# Altium schematic sheet dv_mcu_mcu.SchDoc: =GlobalProjectName
size 410 x 297 mm; ApprovedBy: Утвердил; CheckedBy: Проверил; Author: Разработал; SheetNumber: 2; SheetTotal: 6; PageSetup: Record=PageOptions|CenterHorizontal=True|CenterVertical=True|PrintScale=1.00|XCorrection=1.00|YCorrection=1.00|PrintKind=1|BorderSize=5000000|LeftOffset=0|BottomOffset=0|Orientation=2|PaperLength=1000|PaperWidth=1000|Scale=100|PaperSource=15|PrintQuality=1200|MediaType=1|DitherType=10|PaperKind=A3|PrintScaleMode=1; Weight: -; ScaleFactor: -; NormInspection: Норм.Контр.; Time: Листов
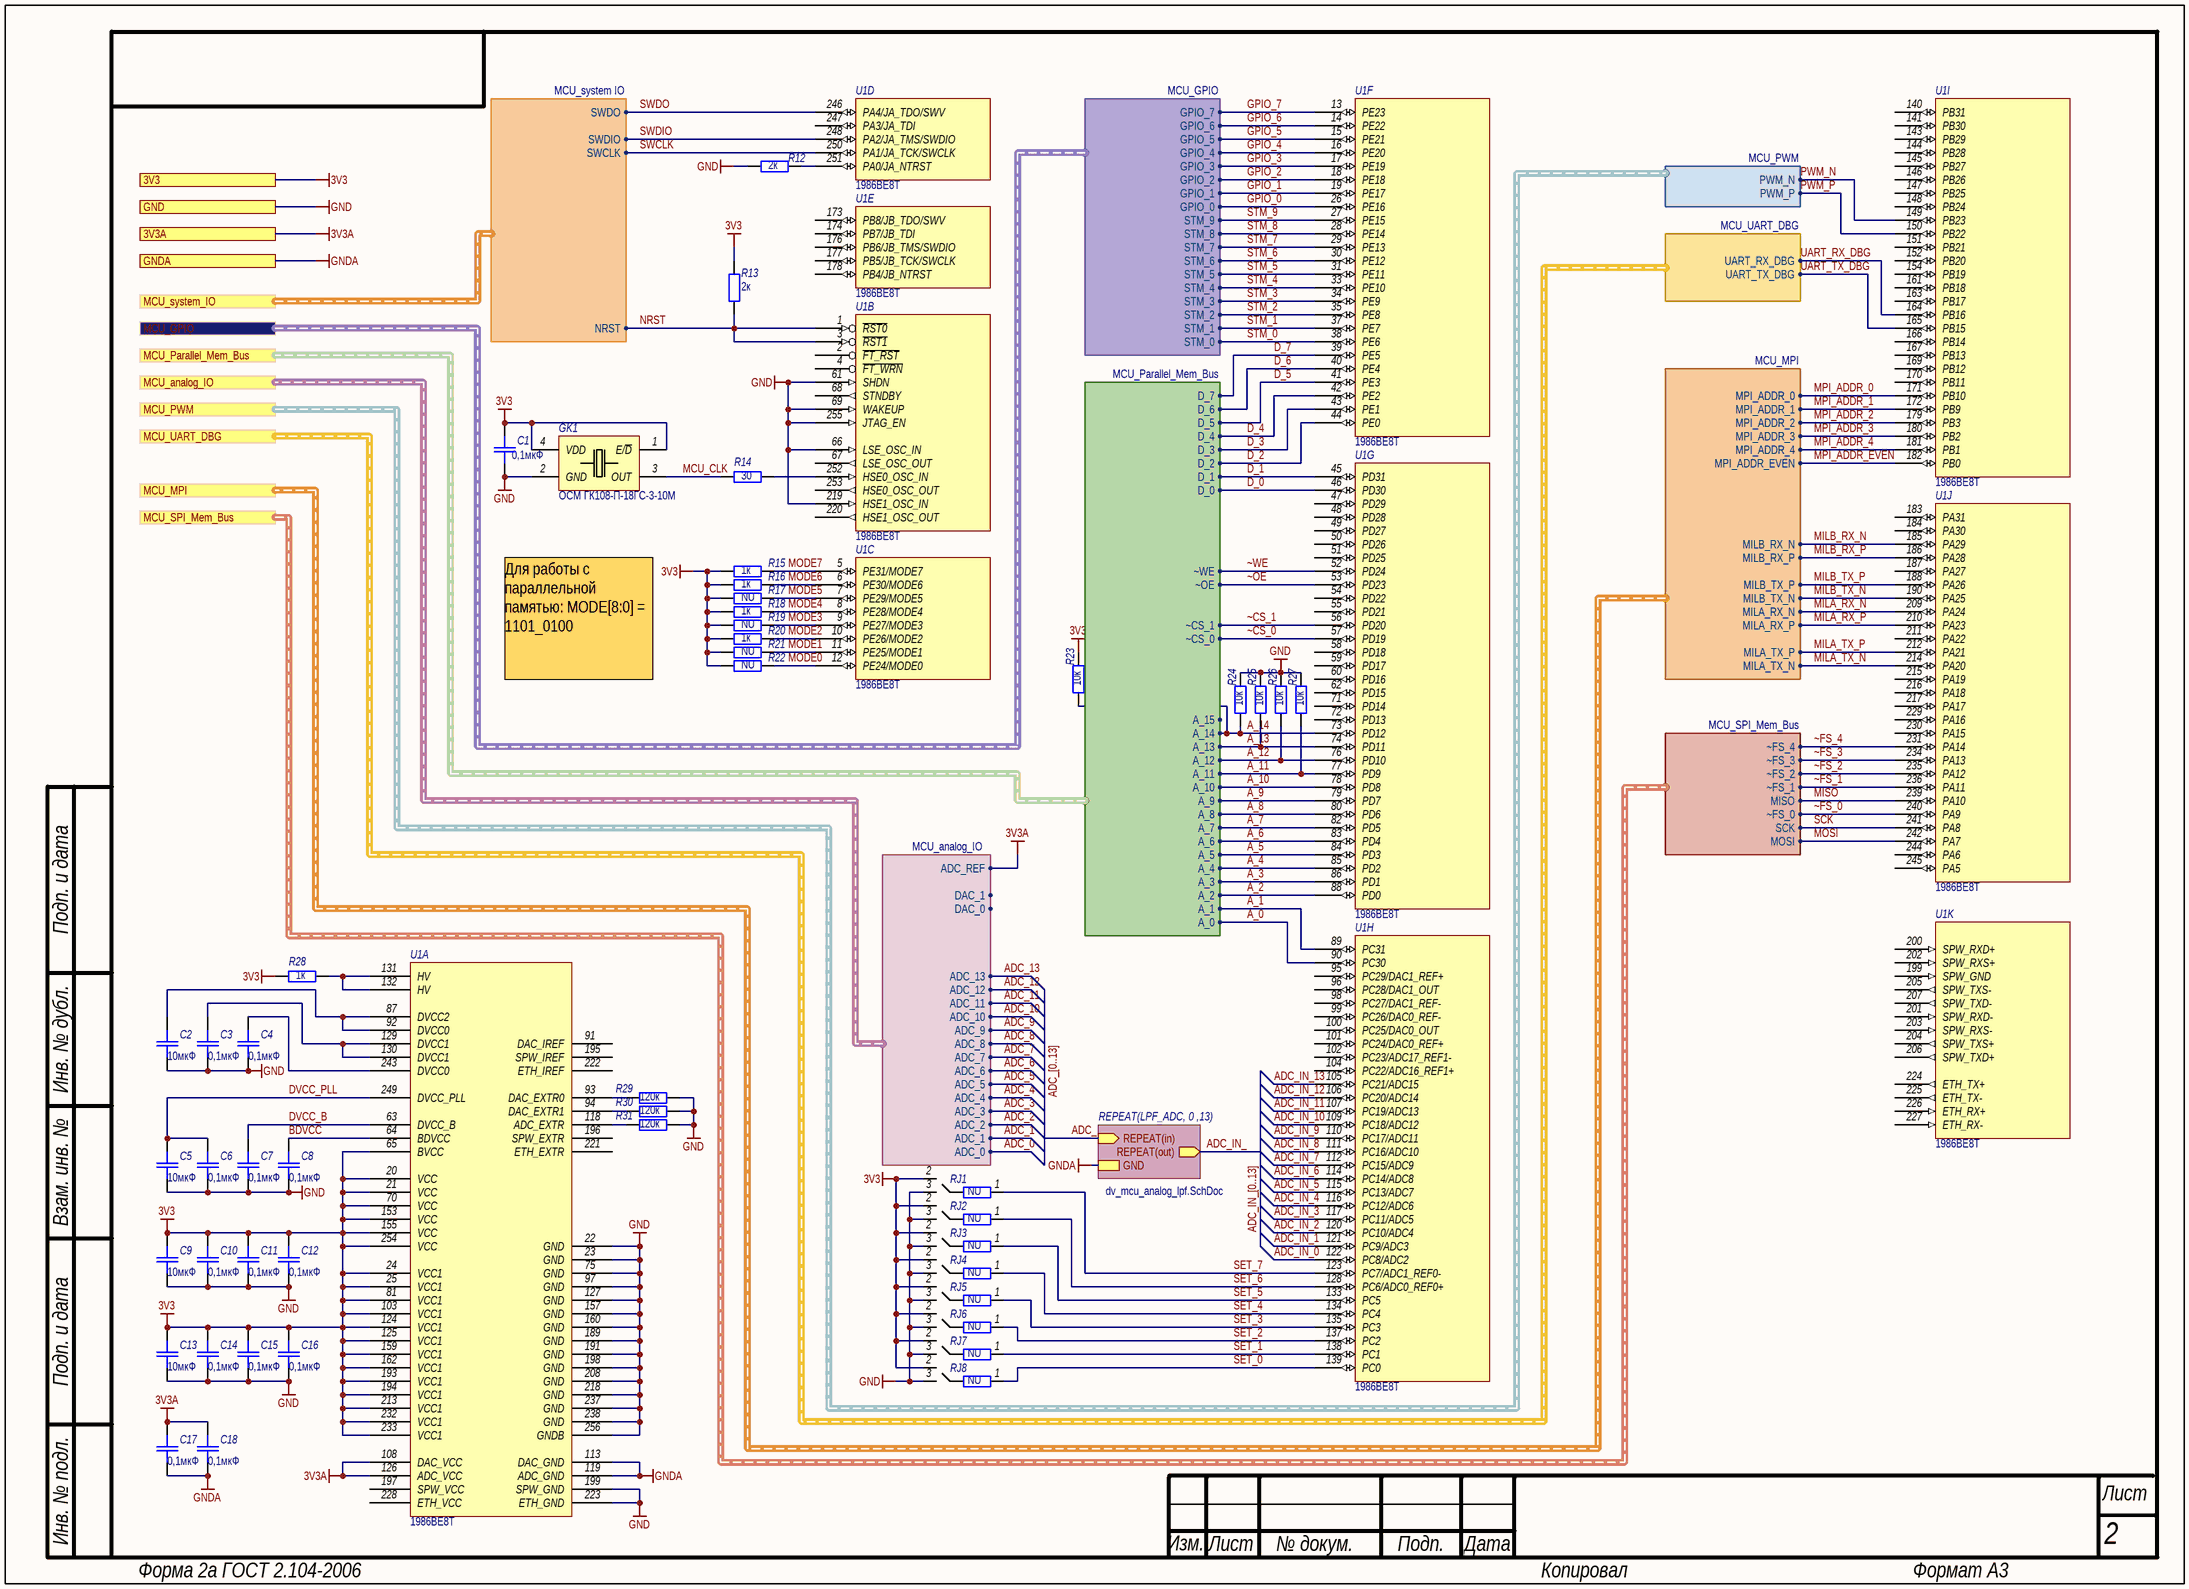
[diagram p0: dv_mcu_mcu.SchDoc]

## Parts
C1  value 0,1мкФ  [SMD_C0805]  (hidden comment: K10-79)
C2  value 10мкФ  [SMD_C0805]  (hidden comment: K10-79)
C3  value 0,1мкФ  [SMD_C0805]  (hidden comment: K10-79)
C4  value 0,1мкФ  [SMD_C0805]  (hidden comment: K10-79)
C5  value 10мкФ  [SMD_C0805]  (hidden comment: K10-79)
C6  value 0,1мкФ  [SMD_C0805]  (hidden comment: K10-79)
C7  value 0,1мкФ  [SMD_C0805]  (hidden comment: K10-79)
C8  value 0,1мкФ  [SMD_C0805]  (hidden comment: K10-79)
C9  value 10мкФ  [SMD_C0805]  (hidden comment: K10-79)
C10  value 0,1мкФ  [SMD_C0805]  (hidden comment: K10-79)
C11  value 0,1мкФ  [SMD_C0805]  (hidden comment: K10-79)
C12  value 0,1мкФ  [SMD_C0805]  (hidden comment: K10-79)
C13  value 10мкФ  [SMD_C0805]  (hidden comment: K10-79)
C14  value 0,1мкФ  [SMD_C0805]  (hidden comment: K10-79)
C15  value 0,1мкФ  [SMD_C0805]  (hidden comment: K10-79)
C16  value 0,1мкФ  [SMD_C0805]  (hidden comment: K10-79)
C17  value 0,1мкФ  [SMD_C0805]  (hidden comment: K10-79)
C18  value 0,1мкФ  [SMD_C0805]  (hidden comment: K10-79)
GK1  Наименование: ОСМ ГК108-П-18ГС-3-10М  [SMD_7050_Crystal_Oscillator]  (hidden comment: GK108)
R12  value 2к  [SMD_0805]  (hidden comment: OSM R1-12)
R13  value 2к  [SMD_0805]  (hidden comment: OSM R1-12)
R14  value 30  [SMD_0805]  (hidden comment: OSM R1-12)
R15  value 1к  [SMD_0805]  (hidden comment: OSM R1-12)
R16  value 1к  [SMD_0805]  (hidden comment: OSM R1-12)
R17  value NU  [SMD_0805]  (hidden comment: OSM R1-12)
R18  value 1к  [SMD_0805]  (hidden comment: OSM R1-12)
R19  value NU  [SMD_0805]  (hidden comment: OSM R1-12)
R20  value 1к  [SMD_0805]  (hidden comment: OSM R1-12)
R21  value NU  [SMD_0805]  (hidden comment: OSM R1-12)
R22  value NU  [SMD_0805]  (hidden comment: OSM R1-12)
R23  value 10к  [SMD_0805]  (hidden comment: OSM R1-12)
R24  value 10к  [SMD_0805]  (hidden comment: OSM R1-12)
R25  value 10к  [SMD_0805]  (hidden comment: OSM R1-12)
R26  value 10к  [SMD_0805]  (hidden comment: OSM R1-12)
R27  value 10к  [SMD_0805]  (hidden comment: OSM R1-12)
R28  value 1к  [SMD_0805]  (hidden comment: OSM R1-12)
R29  value 120к  [SMD_0805]  (hidden comment: OSM R1-12)
R30  value 120к  [SMD_0805]  (hidden comment: OSM R1-12)
R31  value 120к  [SMD_0805]  (hidden comment: OSM R1-12)
RJ1  NU  [SMD_JMP_0402]
RJ2  NU  [SMD_JMP_0402]
RJ3  NU  [SMD_JMP_0402]
RJ4  NU  [SMD_JMP_0402]
RJ5  NU  [SMD_JMP_0402]
RJ6  NU  [SMD_JMP_0402]
RJ7  NU  [SMD_JMP_0402]
RJ8  NU  [SMD_JMP_0402]
U1  1986VE8T  [4244.256-3]  (value not drawn)  (parts A,B,C,D,E,F,G,H,I,J,K of 11)

## Sub-sheets
REPEAT(LPF_ADC, 0 ,13) = dv_mcu_analog_lpf.SchDoc: REPEAT(in) (in), REPEAT(out) (out), GND

## Ports
3V3, 3V3A, GND, GNDA, MCU_analog_IO (harness MCU_analog_IO), MCU_GPIO (harness MCU_GPIO), MCU_MPI (harness MCU_MPI), MCU_Parallel_Mem_Bus (harness MCU_Parallel_Mem_Bus), MCU_PWM (harness MCU_PWM), MCU_SPI_Mem_Bus (harness MCU_SPI_Mem_Bus), MCU_system_IO (harness MCU_system IO), MCU_UART_DBG (harness MCU_UART_DBG)

## Harnesses
MCU_system IO: SWDO, SWDIO, SWCLK, NRST
MCU_analog_IO: ADC_0, ADC_1, ADC_2, ADC_3, ADC_4, ADC_5, ADC_6, ADC_7, ADC_8, ADC_9, DAC_0, DAC_1, ADC_REF, ADC_10, ADC_11, ADC_12, ADC_13
MCU_Parallel_Mem_Bus: D_0, D_7, D_1, D_2, D_3, D_4, D_5, D_6, A_0, ~CS_0, A_1, A_2, A_3, A_4, A_5, A_6, A_7, A_8, A_9, A_10, A_11, A_12, A_13, A_14, A_15, ~OE, ~WE, ~CS_1
MCU_GPIO: GPIO_0, GPIO_1, GPIO_2, GPIO_3, GPIO_4, GPIO_5, GPIO_6, GPIO_7, STM_9, STM_8, STM_7, STM_6, STM_5, STM_4, STM_3, STM_2, STM_1, STM_0
MCU_UART_DBG: UART_TX_DBG, UART_RX_DBG
MCU_MPI: MILB_RX_N, MILB_RX_P, MILB_TX_P, MILB_TX_N, MILA_RX_N, MILA_RX_P, MILA_TX_P, MILA_TX_N, MPI_ADDR_0, MPI_ADDR_1, MPI_ADDR_2, MPI_ADDR_3, MPI_ADDR_4, MPI_ADDR_EVEN
MCU_SPI_Mem_Bus: ~FS_4, MISO, ~FS_0, SCK, MOSI, ~FS_1, ~FS_2, ~FS_3
MCU_PWM: PWM_N, PWM_P

## Nets
3V3: C1.2 C9.2 C10.2 C11.2 C12.2 C13.2 C14.2 C15.2 C16.2 GK1.1(E/~{D}) GK1.4(VDD) R13.2 R15.1 R16.1 R17.1 R18.1 R19.1 R20.1 R21.1 R22.1 R23.2 R28.1 RJ1.2 RJ2.2 RJ3.2 RJ4.2 RJ5.2 RJ6.2 RJ7.2 RJ8.2 U1.20(VCC) U1.21(VCC) U1.24(VCC1) U1.25(VCC1) U1.65(BVCC) U1.70(VCC) U1.81(VCC1) U1.103(VCC1) U1.124(VCC1) U1.125(VCC1) U1.153(VCC) U1.155(VCC) U1.159(VCC1) U1.162(VCC1) U1.193(VCC1) U1.194(VCC1) U1.213(VCC1) U1.232(VCC1) U1.233(VCC1) U1.254(VCC) ; port 3V3
3V3A: C17.2 C18.2 U1.108(DAC_VCC) U1.126(ADC_VCC) ; port 3V3A, port MCU_analog_IO.ADC_REF
GND: C1.1 C2.1 C3.1 C4.1 C5.1 C6.1 C7.1 C8.1 C9.1 C10.1 C11.1 C12.1 C13.1 C14.1 C15.1 C16.1 GK1.2(GND) R12.1 R24.2 R25.2 R26.2 R27.2 R29.2 R30.2 R31.2 RJ1.3 RJ2.3 RJ3.3 RJ4.3 RJ5.3 RJ6.3 RJ7.3 RJ8.3 U1.22(GND) U1.23(GND) U1.61(SHDN) U1.66(LSE_OSC_IN) U1.69(WAKEUP) U1.75(GND) U1.97(GND) U1.127(GND) U1.157(GND) U1.160(GND) U1.189(GND) U1.191(GND) U1.198(GND) U1.199(SPW_GND) U1.208(GND) U1.218(GND) U1.219(HSE1_OSC_IN) U1.223(ETH_GND) U1.237(GND) U1.238(GND) U1.255(JTAG_EN) U1.256(GNDB) ; port GND
GNDA: C17.1 C18.1 U1.113(DAC_GND) U1.119(ADC_GND) ; port GNDA, sheet REPEAT(LPF_ADC, 0 ,13)/GND
A_0: U1.90(PC30) ; port MCU_Parallel_Mem_Bus.A_0
A_1: U1.89(PC31) ; port MCU_Parallel_Mem_Bus.A_1
A_2: U1.88(PD0) ; port MCU_Parallel_Mem_Bus.A_2
A_3: U1.86(PD1) ; port MCU_Parallel_Mem_Bus.A_3
A_4: U1.85(PD2) ; port MCU_Parallel_Mem_Bus.A_4
A_5: U1.84(PD3) ; port MCU_Parallel_Mem_Bus.A_5
A_6: U1.83(PD4) ; port MCU_Parallel_Mem_Bus.A_6
A_7: U1.82(PD5) ; port MCU_Parallel_Mem_Bus.A_7
A_8: U1.80(PD6) ; port MCU_Parallel_Mem_Bus.A_8
A_9: U1.79(PD7) ; port MCU_Parallel_Mem_Bus.A_9
A_10: U1.78(PD8) ; port MCU_Parallel_Mem_Bus.A_10
A_11: R27.1 U1.77(PD9) ; port MCU_Parallel_Mem_Bus.A_11
A_12: R26.1 U1.76(PD10) ; port MCU_Parallel_Mem_Bus.A_12
A_13: R25.1 U1.74(PD11) ; port MCU_Parallel_Mem_Bus.A_13
A_14: R23.1 R24.1 U1.73(PD12) ; port MCU_Parallel_Mem_Bus.A_14
ADC_: sheet REPEAT(LPF_ADC, 0 ,13)/REPEAT(in)
ADC_0: port MCU_analog_IO.ADC_0
ADC_1: port MCU_analog_IO.ADC_1
ADC_2: port MCU_analog_IO.ADC_2
ADC_3: port MCU_analog_IO.ADC_3
ADC_4: port MCU_analog_IO.ADC_4
ADC_5: port MCU_analog_IO.ADC_5
ADC_6: port MCU_analog_IO.ADC_6
ADC_7: port MCU_analog_IO.ADC_7
ADC_8: port MCU_analog_IO.ADC_8
ADC_9: port MCU_analog_IO.ADC_9
ADC_10: port MCU_analog_IO.ADC_10
ADC_11: port MCU_analog_IO.ADC_11
ADC_12: port MCU_analog_IO.ADC_12
ADC_13: port MCU_analog_IO.ADC_13
ADC_IN_: sheet REPEAT(LPF_ADC, 0 ,13)/REPEAT(out)
ADC_IN_0: U1.122(PC8/ADC2)
ADC_IN_1: U1.121(PC9/ADC3)
ADC_IN_2: U1.120(PC10/ADC4)
ADC_IN_3: U1.117(PC11/ADC5)
ADC_IN_4: U1.116(PC12/ADC6)
ADC_IN_5: U1.115(PC13/ADC7)
ADC_IN_6: U1.114(PC14/ADC8)
ADC_IN_7: U1.112(PC15/ADC9)
ADC_IN_8: U1.111(PC16/ADC10)
ADC_IN_9: U1.110(PC17/ADC11)
ADC_IN_10: U1.109(PC18/ADC12)
ADC_IN_11: U1.107(PC19/ADC13)
ADC_IN_12: U1.106(PC20/ADC14)
ADC_IN_13: U1.105(PC21/ADC15)
BDVCC: C8.2 U1.64(BDVCC)
D_0: U1.46(PD30) ; port MCU_Parallel_Mem_Bus.D_0
D_1: U1.45(PD31) ; port MCU_Parallel_Mem_Bus.D_1
D_2: U1.44(PE0) ; port MCU_Parallel_Mem_Bus.D_2
D_3: U1.43(PE1) ; port MCU_Parallel_Mem_Bus.D_3
D_4: U1.42(PE2) ; port MCU_Parallel_Mem_Bus.D_4
D_5: U1.41(PE3) ; port MCU_Parallel_Mem_Bus.D_5
D_6: U1.40(PE4) ; port MCU_Parallel_Mem_Bus.D_6
D_7: U1.39(PE5) ; port MCU_Parallel_Mem_Bus.D_7
DVCC_B: C7.2 U1.63(DVCC_B)
DVCC_PLL: C5.2 C6.2 U1.249(DVCC_PLL)
GPIO_0: U1.26(PE16) ; port MCU_GPIO.GPIO_0
GPIO_1: U1.19(PE17) ; port MCU_GPIO.GPIO_1
GPIO_2: U1.18(PE18) ; port MCU_GPIO.GPIO_2
GPIO_3: U1.17(PE19) ; port MCU_GPIO.GPIO_3
GPIO_4: U1.16(PE20) ; port MCU_GPIO.GPIO_4
GPIO_5: U1.15(PE21) ; port MCU_GPIO.GPIO_5
GPIO_6: U1.14(PE22) ; port MCU_GPIO.GPIO_6
GPIO_7: U1.13(PE23) ; port MCU_GPIO.GPIO_7
MCU_CLK: GK1.3(OUT) R14.1
MILA_RX_N: U1.209(PA24) ; port MCU_MPI.MILA_RX_N
MILA_RX_P: U1.210(PA23) ; port MCU_MPI.MILA_RX_P
MILA_TX_N: U1.214(PA20) ; port MCU_MPI.MILA_TX_N
MILA_TX_P: U1.212(PA21) ; port MCU_MPI.MILA_TX_P
MILB_RX_N: U1.185(PA29) ; port MCU_MPI.MILB_RX_N
MILB_RX_P: U1.186(PA28) ; port MCU_MPI.MILB_RX_P
MILB_TX_N: U1.190(PA25) ; port MCU_MPI.MILB_TX_N
MILB_TX_P: U1.188(PA26) ; port MCU_MPI.MILB_TX_P
MISO: U1.239(PA10) ; port MCU_SPI_Mem_Bus.MISO
MODE0: R22.2 U1.12(PE24/MODE0)
MODE1: R21.2 U1.11(PE25/MODE1)
MODE2: R20.2 U1.10(PE26/MODE2)
MODE3: R19.2 U1.9(PE27/MODE3)
MODE4: R18.2 U1.8(PE28/MODE4)
MODE5: R17.2 U1.7(PE29/MODE5)
MODE6: R16.2 U1.6(PE30/MODE6)
MODE7: R15.2 U1.5(PE31/MODE7)
MOSI: U1.242(PA7) ; port MCU_SPI_Mem_Bus.MOSI
MPI_ADDR_0: U1.171(PB10) ; port MCU_MPI.MPI_ADDR_0
MPI_ADDR_1: U1.172(PB9) ; port MCU_MPI.MPI_ADDR_1
MPI_ADDR_2: U1.179(PB3) ; port MCU_MPI.MPI_ADDR_2
MPI_ADDR_3: U1.180(PB2) ; port MCU_MPI.MPI_ADDR_3
MPI_ADDR_4: U1.181(PB1) ; port MCU_MPI.MPI_ADDR_4
MPI_ADDR_EVEN: U1.182(PB0) ; port MCU_MPI.MPI_ADDR_EVEN
NRST: R13.1 U1.1(~{RST0}) U1.3(~{RST1}) ; port MCU_system_IO.NRST
PWM_N: U1.149(PB23) ; port MCU_PWM.PWM_N
PWM_P: U1.150(PB22) ; port MCU_PWM.PWM_P
SCK: U1.241(PA8) ; port MCU_SPI_Mem_Bus.SCK
SET_0: RJ8.1 U1.139(PC0)
SET_1: RJ7.1 U1.138(PC1)
SET_2: RJ6.1 U1.137(PC2)
SET_3: RJ5.1 U1.135(PC3)
SET_4: RJ4.1 U1.134(PC4)
SET_5: RJ3.1 U1.133(PC5)
SET_6: RJ2.1 U1.128(PC6/ADC0_REF0+)
SET_7: RJ1.1 U1.123(PC7/ADC1_REF0-)
STM_0: U1.38(PE6) ; port MCU_GPIO.STM_0
STM_1: U1.37(PE7) ; port MCU_GPIO.STM_1
STM_2: U1.35(PE8) ; port MCU_GPIO.STM_2
STM_3: U1.34(PE9) ; port MCU_GPIO.STM_3
STM_4: U1.33(PE10) ; port MCU_GPIO.STM_4
STM_5: U1.31(PE11) ; port MCU_GPIO.STM_5
STM_6: U1.30(PE12) ; port MCU_GPIO.STM_6
STM_7: U1.29(PE13) ; port MCU_GPIO.STM_7
STM_8: U1.28(PE14) ; port MCU_GPIO.STM_8
STM_9: U1.27(PE15) ; port MCU_GPIO.STM_9
SWCLK: U1.250(PA1/JA_TCK/SWCLK) ; port MCU_system_IO.SWCLK
SWDIO: U1.248(PA2/JA_TMS/SWDIO) ; port MCU_system_IO.SWDIO
SWDO: U1.246(PA4/JA_TDO/SWV) ; port MCU_system_IO.SWDO
UART_RX_DBG: U1.164(PB16) ; port MCU_UART_DBG.UART_RX_DBG
UART_TX_DBG: U1.165(PB15) ; port MCU_UART_DBG.UART_TX_DBG
~CS_0: U1.57(PD19) ; port MCU_Parallel_Mem_Bus.~CS_0
~CS_1: U1.56(PD20) ; port MCU_Parallel_Mem_Bus.~CS_1
~FS_0: U1.240(PA9) ; port MCU_SPI_Mem_Bus.~FS_0
~FS_1: U1.236(PA11) ; port MCU_SPI_Mem_Bus.~FS_1
~FS_2: U1.235(PA12) ; port MCU_SPI_Mem_Bus.~FS_2
~FS_3: U1.234(PA13) ; port MCU_SPI_Mem_Bus.~FS_3
~FS_4: U1.231(PA14) ; port MCU_SPI_Mem_Bus.~FS_4
~OE: U1.53(PD23) ; port MCU_Parallel_Mem_Bus.~OE
~WE: U1.52(PD24) ; port MCU_Parallel_Mem_Bus.~WE
NetC2_2: C2.2 U1.87(DVCC2) U1.92(DVCC0)
NetC3_2: C3.2 U1.129(DVCC1) U1.130(DVCC1)
NetC4_2: C4.2 U1.243(DVCC0)
NetR12_2: R12.2 U1.251(PA0/JA_NTRST)
NetR14_2: R14.2 U1.252(HSE0_OSC_IN)
NetR28_2: R28.2 U1.131(HV) U1.132(HV)
NetR29_1: R29.1 U1.93(DAC_EXTR0)
NetR30_1: R30.1 U1.94(DAC_EXTR1)
NetR31_1: R31.1 U1.118(ADC_EXTR)

Not connected (* = marked no-connect by the designer): U1 2(~{FT_RST}) 4(~{FT_WRN}) 47(PD29) 48(PD28) 49(PD27) 50(PD26) 51(PD25) 54(PD22) 55(PD21) 58(PD18) 59(PD17) 60(PD16) 62(PD15) 67(LSE_OSC_OUT) 68(STNDBY) 71(PD14) 72(PD13) 91(DAC_IREF) 95(PC29/DAC1_REF+) 96(PC28/DAC1_OUT) 98(PC27/DAC1_REF-) 99(PC26/DAC0_REF-) 100(PC25/DAC0_OUT) 101(PC24/DAC0_REF+) 102(PC23/ADC17_REF1-) 104(PC22/ADC16_REF1+) 140(PB31) 141(PB30) 143(PB29) 144(PB28) 145(PB27) 146(PB26) 147(PB25) 148(PB24) 151(PB21) 152(PB20) 154(PB19) 161(PB18) 163(PB17) 166(PB14) 167(PB13) 169(PB12) 170(PB11) 173(PB8/JB_TDO/SWV) 174(PB7/JB_TDI) 176(PB6/JB_TMS/SWDIO) 177(PB5/JB_TCK/SWCLK) 178(PB4/JB_NTRST) 183(PA31) 184(PA30) 187(PA27) 195(SPW_IREF) 196(SPW_EXTR) 197(SPW_VCC) 200(SPW_RXD+) 201(SPW_RXD-) 202(SPW_RXS+) 203(SPW_RXS-) 204(SPW_TXS+) 205(SPW_TXS-) 206(SPW_TXD+) 207(SPW_TXD-) 211(PA22) 215(PA19) 216(PA18) 217(PA17) 220(HSE1_OSC_OUT) 221(ETH_EXTR) 222(ETH_IREF) 224(ETH_TX+) 225(ETH_TX-) 226(ETH_RX+) 227(ETH_RX-) 228(ETH_VCC) 229(PA16) 230(PA15) 244(PA6) 245(PA5) 247(PA3/JA_TDI) 253(HSE0_OSC_OUT)

## Buses and harness runs
bus ADC_[0..13]
bus ADC_IN_[0..13]

## Notes on the sheet
- Для работы с параллельной памятью: MODE[8:0] = 1101_0100
- Подп. и дата
- Инв. № дубл.
- Взам. инв. №
- Инв. № подл.
- Изм.
- Лист
- № докум.
- Подп.
- Дата
- Форма 2а ГОСТ 2.104-2006
- Копировал
- Формат А3

## Library data of the parts
C1-C18 = Capacitor: Назначение: SMD-конденсатор; Наименование: К10-79; Потребление, Вт: 0; Напряжение: В; Точность: %
GK1 = Crystal_Oscillator: Crystall oscillator, CMOS, 3.3V, SMD7050; Назначение: Кварцевый генератор; Потребление, Вт: 0,165; ComponentLink1Description: DataSheet; ComponentLink1URL: http://www.lit-phonon.ru/downloads/GK108-P.pdf
R12-R31 = Resistor: Наименование: ОСМ Р1-12; Назначение: SMD-резистор; Потребление, Вт: 0,001; Точность: %
RJ1-RJ8 = Resistor_Jamper: Resistor-Jumper; Назначение: Резистор для выбора режима; Наименование: Р1-12-0.125 ОСМ; Потребление, Вт: 0,0; Value: NU
U1 = 1986BE8T: ARM CortexM4F микроконтроллер; Назначение: АРМ микроконтроллер; Потребление, Вт: *; ComponentLink1Description: DataSheet; ComponentLink1URL: https://ic.milandr.ru/upload/iblock/62c/62ca58d6ede1a3e06d56be1e19dbdbc8.pdf; ComponentLink2Description: Errata; ComponentLink2URL: https://ic.milandr.ru/upload/iblock/379/379105061a67e6dd9373b458eff4ec3a.pdf; Наименование: 1986BE8T